# Altium schematic sheet atmega2560.SchDoc
size A2
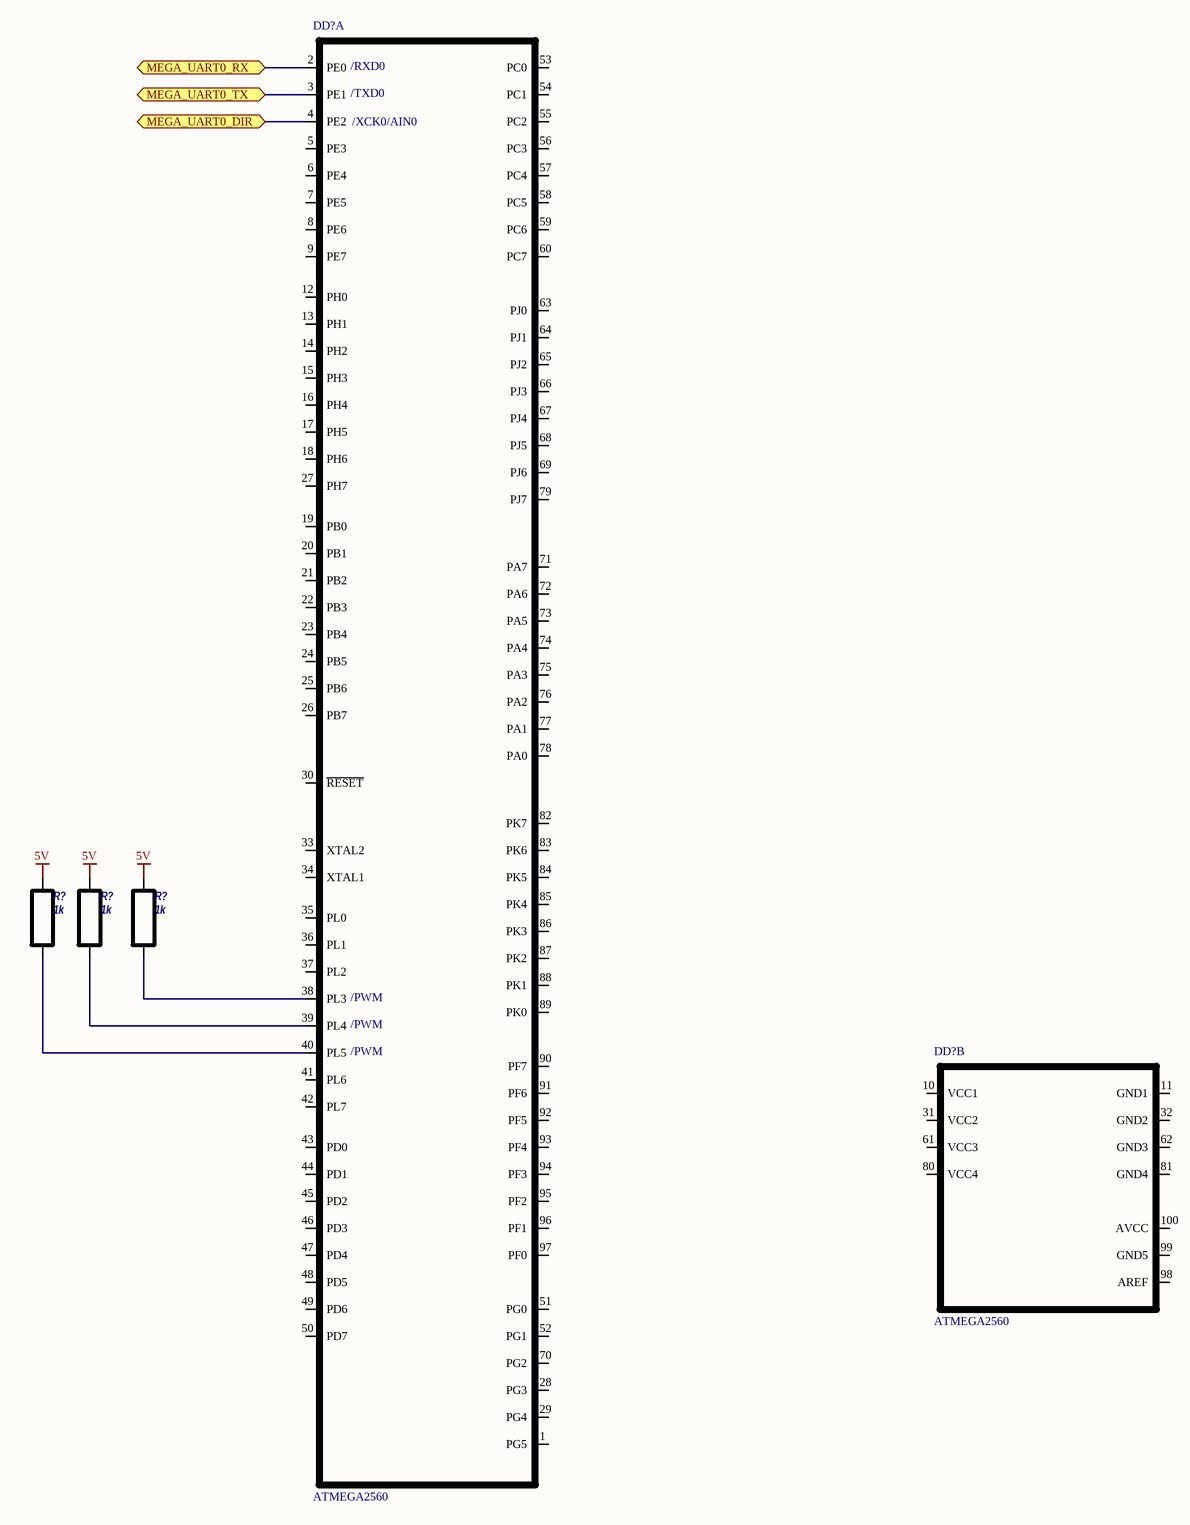
[diagram p0: atmega2560.SchDoc]

## Parts
(Parts that share a designator on the sheet are numbered #1, #2 ... from top to bottom, then left to right.)
DD?#1  ATMEGA2560  [TQFP100]  (part A of 2)
DD?#2  ATMEGA2560  [TQFP100]  (part B of 2)
R?#1  1k  [R0805]
R?#2  1k  [R0805]
R?#3  1k  [R0805]

## Ports
MEGA_UART0_DIR, MEGA_UART0_RX, MEGA_UART0_TX

## Nets
5V: R?#1.2 R?#2.2 R?#3.2
MEGA_UART0_DIR: DD?#1.4(PE2) ; port MEGA_UART0_DIR
MEGA_UART0_RX: DD?#1.2(PE0) ; port MEGA_UART0_RX
MEGA_UART0_TX: DD?#1.3(PE1) ; port MEGA_UART0_TX
NetDD?#1_38: DD?#1.38(PL3) R?#3.1
NetDD?#1_39: DD?#1.39(PL4) R?#2.1
NetDD?#1_40: DD?#1.40(PL5) R?#1.1

Not connected (* = marked no-connect by the designer): DD?#1 1(PG5) 5(PE3) 6(PE4) 7(PE5) 8(PE6) 9(PE7) 12(PH0) 13(PH1) 14(PH2) 15(PH3) 16(PH4) 17(PH5) 18(PH6) 19(PB0) 20(PB1) 21(PB2) 22(PB3) 23(PB4) 24(PB5) 25(PB6) 26(PB7) 27(PH7) 28(PG3) 29(PG4) 30(~{RESET}) 33(XTAL2) 34(XTAL1) 35(PL0) 36(PL1) 37(PL2) 41(PL6) 42(PL7) 43(PD0) 44(PD1) 45(PD2) 46(PD3) 47(PD4) 48(PD5) 49(PD6) 50(PD7) 51(PG0) 52(PG1) 53(PC0) 54(PC1) 55(PC2) 56(PC3) 57(PC4) 58(PC5) 59(PC6) 60(PC7) 63(PJ0) 64(PJ1) 65(PJ2) 66(PJ3) 67(PJ4) 68(PJ5) 69(PJ6) 70(PG2) 71(PA7) 72(PA6) 73(PA5) 74(PA4) 75(PA3) 76(PA2) 77(PA1) 78(PA0) 79(PJ7) 82(PK7) 83(PK6) 84(PK5) 85(PK4) 86(PK3) 87(PK2) 88(PK1) 89(PK0) 90(PF7) 91(PF6) 92(PF5) 93(PF4) 94(PF3) 95(PF2) 96(PF1) 97(PF0); DD?#2 10(VCC1) 11(GND1) 31(VCC2) 32(GND2) 61(VCC3) 62(GND3) 80(VCC4) 81(GND4) 98(AREF) 99(GND5) 100(AVCC)

## Notes on the sheet
- (near DD?#1) /TXD0
- (near DD?#1) /RXD0
- (near DD?#1) /XCK0/AIN0
- (near DD?#1) /PWM

## Library data of the parts
DD?#1 DD?#2 = ATMEGA2560: Atmega2560 - TQFP100; Velue: *
R?#1-R?#3 = R: SMD resistor; Value: 1k